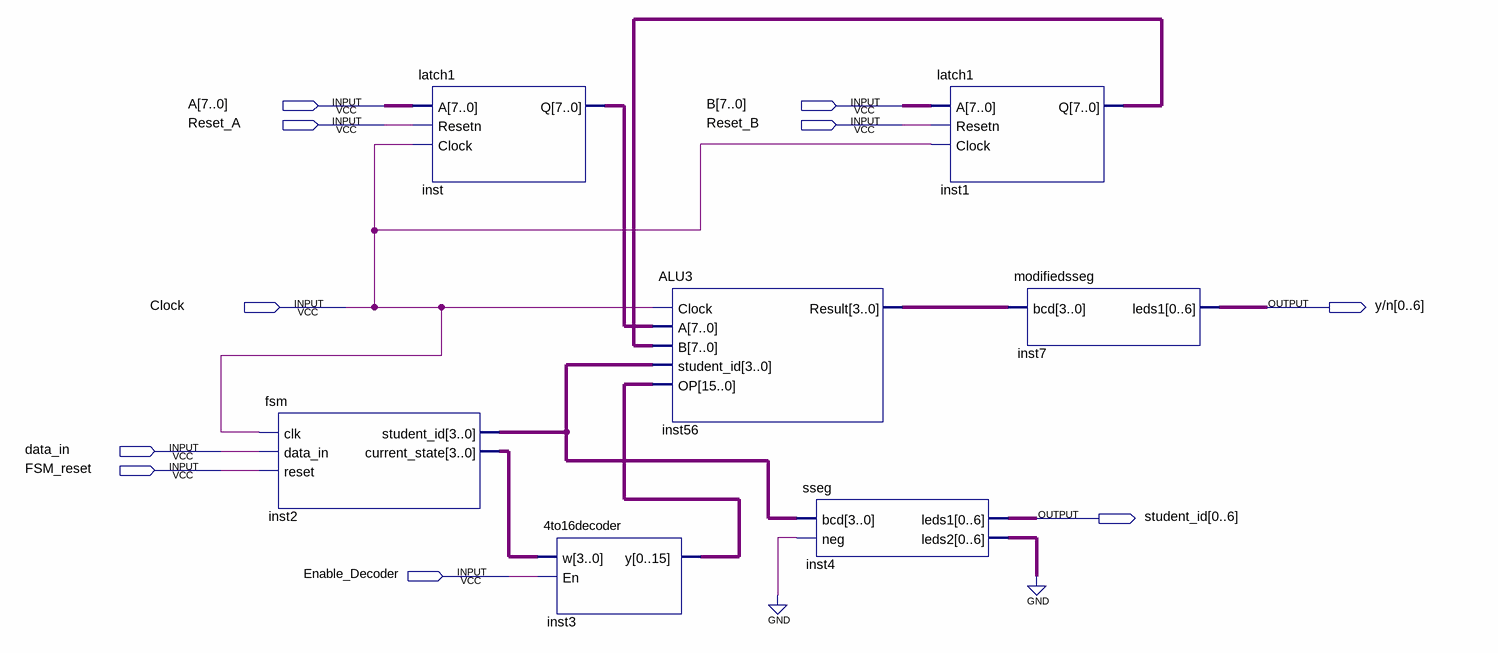
[diagram p0: schematic sheet]
// Quartus schematic problem3.bdf as structural Verilog: 7 symbols, 10 pins
module problem3 (
  input  [7:0] A,
  input  [7:0] B,
  input  Reset_A,
  input  Reset_B,
  input  Clock,
  input  data_in,
  input  FSM_reset,
  input  Enable_Decoder,
  output [0:6] \y/n ,
  output [0:6] student_id
);

  wire [3:0] inst2_current_state, inst2_student_id, inst56_result;
  wire [6:0] inst4_leds2;
  wire [7:0] inst1_q, inst_q;
  wire [15:0] inst3_y;

  fsm inst2 (
    .clk(Clock), .data_in(data_in), .reset(FSM_reset), .student_id(inst2_student_id),
    .current_state(inst2_current_state));
  latch1 inst (.A(A), .Resetn(Reset_A), .Clock(Clock), .Q(inst_q));
  \4to16decoder  inst3 (.w(inst2_current_state), .En(Enable_Decoder), .y(inst3_y));
  ALU3 inst56 (
    .Clock(Clock), .A(inst_q), .B(inst1_q), .student_id(inst2_student_id), .OP(inst3_y),
    .Result(inst56_result));
  sseg inst4 (.bcd(inst2_student_id), .neg(1'b0), .leds1(student_id), .leds2(inst4_leds2));
  latch1 inst1 (.A(B), .Resetn(Reset_B), .Clock(Clock), .Q(inst1_q));
  modifiedsseg inst7 (.bcd(inst56_result), .leds1(\y/n ));
  // also tied to GND on the sheet: {inst4_leds2[0], inst4_leds2[1], inst4_leds2[2], inst4_leds2[3], inst4_leds2[4], inst4_leds2[5], inst4_leds2[6]}
endmodule
